# Altium schematic sheet sketch identifier.SchDoc: Sketch Identifier
size 148 x 209 mm; Organization: ORGANIZATION; Address1: ADDRESS 1; Address2: ADDRESS 2; Address3: ADDRESS 3; Address4: ADDRESS 4; Revision: V1.2; Title2: EDES301; ENG_APP_DATE: --/--/--; DSN_APP_DATE: --/--/--; CHK_APP_DATE: --/--/--
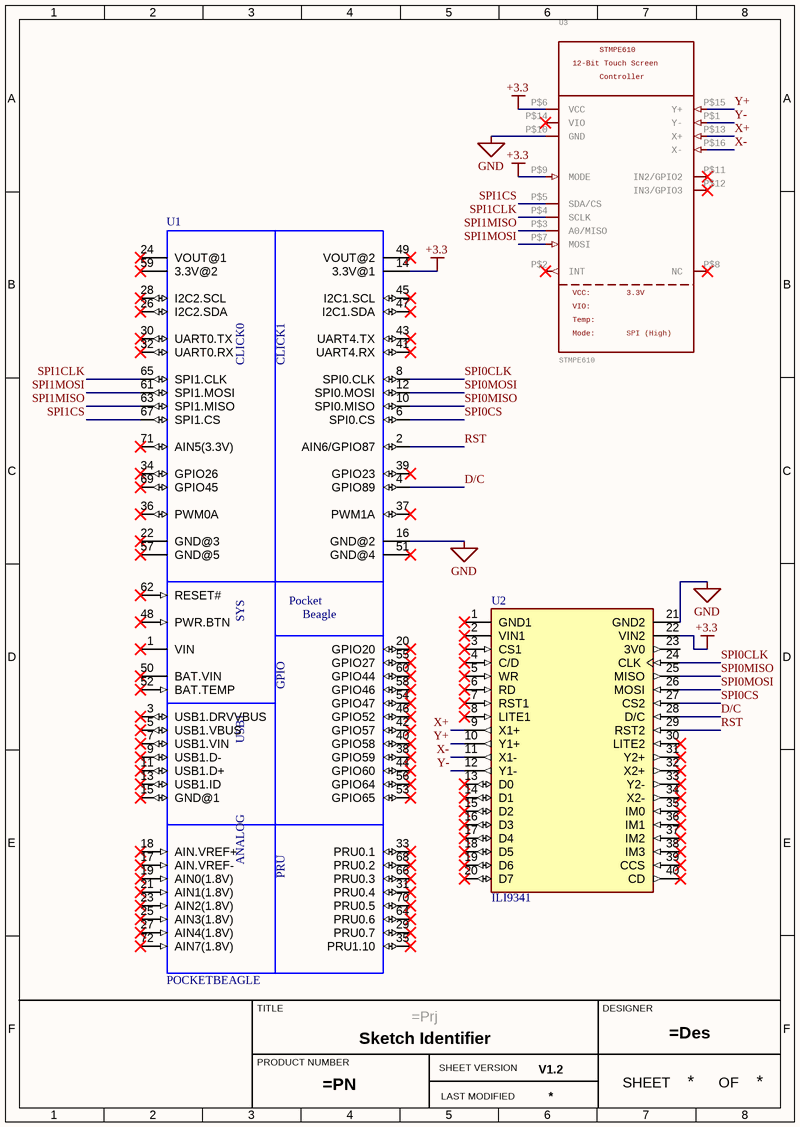
[diagram p0: sketch identifier.SchDoc]

## Parts
U1  POCKETBEAGLE  [POCKETBEAGLE]
U2  ILI9341  [ADAFRUIT_2478]
U3  STMPE610  VCC: VCC:  1.8-3.6V: 3.3V  VIO: VIO:  Temp: Temp:  12-BitTouchScreen: 12-Bit Touch Screen  Mode: Mode:  [QFN16_3MM]

## Nets
+3.3: U1.14(3.3V@1) U2.22(VIN2) U3.P$6(VCC) U3.P$9(MODE)
GND: U1.16(GND@2) U2.21(GND2) U3.P$10(GND)
D/C: U1.4(GPIO89) U2.28(D/C)
RST: U1.2(AIN6/GPIO87) U2.29(RST2)
SPI0CLK: U1.8(SPI0.CLK) U2.24(CLK)
SPI0CS: U1.6(SPI0.CS) U2.27(CS2)
SPI0MISO: U1.10(SPI0.MISO) U2.25(MISO)
SPI0MOSI: U1.12(SPI0.MOSI) U2.26(MOSI)
SPI1CLK: U1.65(SPI1.CLK) U3.P$4(SCLK)
SPI1CS: U1.67(SPI1.CS) U3.P$5(SDA/CS)
SPI1MISO: U1.63(SPI1.MISO) U3.P$3(A0/MISO)
SPI1MOSI: U1.61(SPI1.MOSI) U3.P$7(MOSI)
X+: U2.9(X1+) U3.P$13(X+)
X-: U2.11(X1-) U3.P$16(X-)
Y+: U2.10(Y1+) U3.P$15(Y+)
Y-: U2.12(Y1-) U3.P$1(Y-)

Not connected (* = marked no-connect by the designer): U1 1(VIN)* 3(USB1.DRVVBUS)* 5(USB1.VBUS)* 7(USB1.VIN)* 9(USB1.D-)* 11(USB1.D+)* 13(USB1.ID)* 15(GND@1)* 17(AIN.VREF-)* 18(AIN.VREF+)* 19(AIN0(1.8V))* 20(GPIO20)* 21(AIN1(1.8V))* 22(GND@3)* 23(AIN2(1.8V))* 24(VOUT@1)* 25(AIN3(1.8V))* 26(I2C2.SDA)* 27(AIN4(1.8V))* 28(I2C2.SCL)* 29(PRU0.7)* 30(UART0.TX)* 31(PRU0.4)* 32(UART0.RX)* 33(PRU0.1)* 34(GPIO26)* 35(PRU1.10)* 36(PWM0A)* 37(PWM1A)* 38(GPIO59)* 39(GPIO23)* 40(GPIO58)* 41(UART4.RX)* 42(GPIO57)* 43(UART4.TX)* 44(GPIO60)* 45(I2C1.SCL)* 46(GPIO52)* 47(I2C1.SDA)* 48(PWR.BTN)* 49(VOUT@2)* 50(BAT.VIN)* 51(GND@4)* 52(BAT.TEMP)* 53(GPIO65)* 54(GPIO47)* 55(GPIO27)* 56(GPIO64)* 57(GND@5)* 58(GPIO46)* 59(3.3V@2)* 60(GPIO44)* 62(RESET#)* 64(PRU0.6)* 66(PRU0.3)* 68(PRU0.2)* 69(GPIO45)* 70(PRU0.5)* 71(AIN5(3.3V))* 72(AIN7(1.8V))*; U2 1(GND1)* 2(VIN1)* 3(CS1)* 4(C/D)* 5(WR)* 6(RD)* 7(RST1)* 8(LITE1)* 13(D0)* 14(D1)* 15(D2)* 16(D3)* 17(D4)* 18(D5)* 19(D6)* 20(D7)* 23(3V0) 30(LITE2)* 31(Y2+)* 32(X2+)* 33(Y2-)* 34(X2-)* 35(IM0)* 36(IM1)* 37(IM2)* 38(IM3)* 39(CCS)* 40(CD)*; U3 P$2(INT)* P$8(NC)* P$11(IN2/GPIO2)* P$12(IN3/GPIO3)* P$14(VIO)*

## Notes on the sheet
- SPI (High)
- TITLE
- DESIGNER
- PRODUCT NUMBER
- SHEET VERSION
- SHEET
- OF
- LAST MODIFIED
- (in symbol CMP-003-000002-1) CLICK0; CLICK1; Pocket; SYS; Beagle; GPIO; USB1; ANALOG; PRU

## Library data of the parts
U1 = CMP-003-000002-1: OSD3358 PocketBeagle - ARMÂ® CortexÂ®-A8 MPU Embedded Evaluation Board; MF: Beagleboard; Source: POCKETBEAGLE.SchLib; Component Type: Standard; Price: None; Check_prices: https://www.snapeda.com/parts/POCKETBEAGLE/BeagleBoard/view-part/4222356/?ref=eda; MP: POCKETBEAGLE; Pin Count: 72; Design Item ID: POCKETBEAGLE; SnapEDA_Link: https://www.snapeda.com/parts/POCKETBEAGLE/BeagleBoard/view-part/4222356/?ref=snap; Value: *; Availability: No availability data; Package: None
U2 = CMP-005-000000-1: Resistive Graphic LCD Display Module Red, Green, Blue (RGB) TFT - Color Parallel, 8-Bit, SPI 2.4 (60.96mm) 240 x 320; MF: Adafruit Industries; Availability: In Stock; SnapEDA_Link: https://www.snapeda.com/parts/2478/Adafruit+Industries+LLC/view-part/?ref=snap; Design Item ID: 2478; Package: NON STANDARD Adafruit; Component Type: Standard; Price: None; Pin Count: 40; MP: 2478; Source: 2478.SchLib; Value: *; Check_prices: https://www.snapeda.com/parts/2478/Adafruit+Industries+LLC/view-part/?ref=eda
U3 = CMP-012-000002-1: STMPE610 - 12-Bit Touch Screen Controller; 0: I2C/1=SPI=0=I2C/1=SPI; GateName_1: G$1; STMPE610: STMPE610; Controller: Controller; LibraryName: microbuilder; DeviceSetName: STMPE610; Pin Count: 16; Component Type: Standard; Design Item ID: STMPE610; SymbolName_1: STMPE610; Source: Adafruit STMPE610.SCHLIB